# Altium schematic sheet 手环.SchDoc
size E
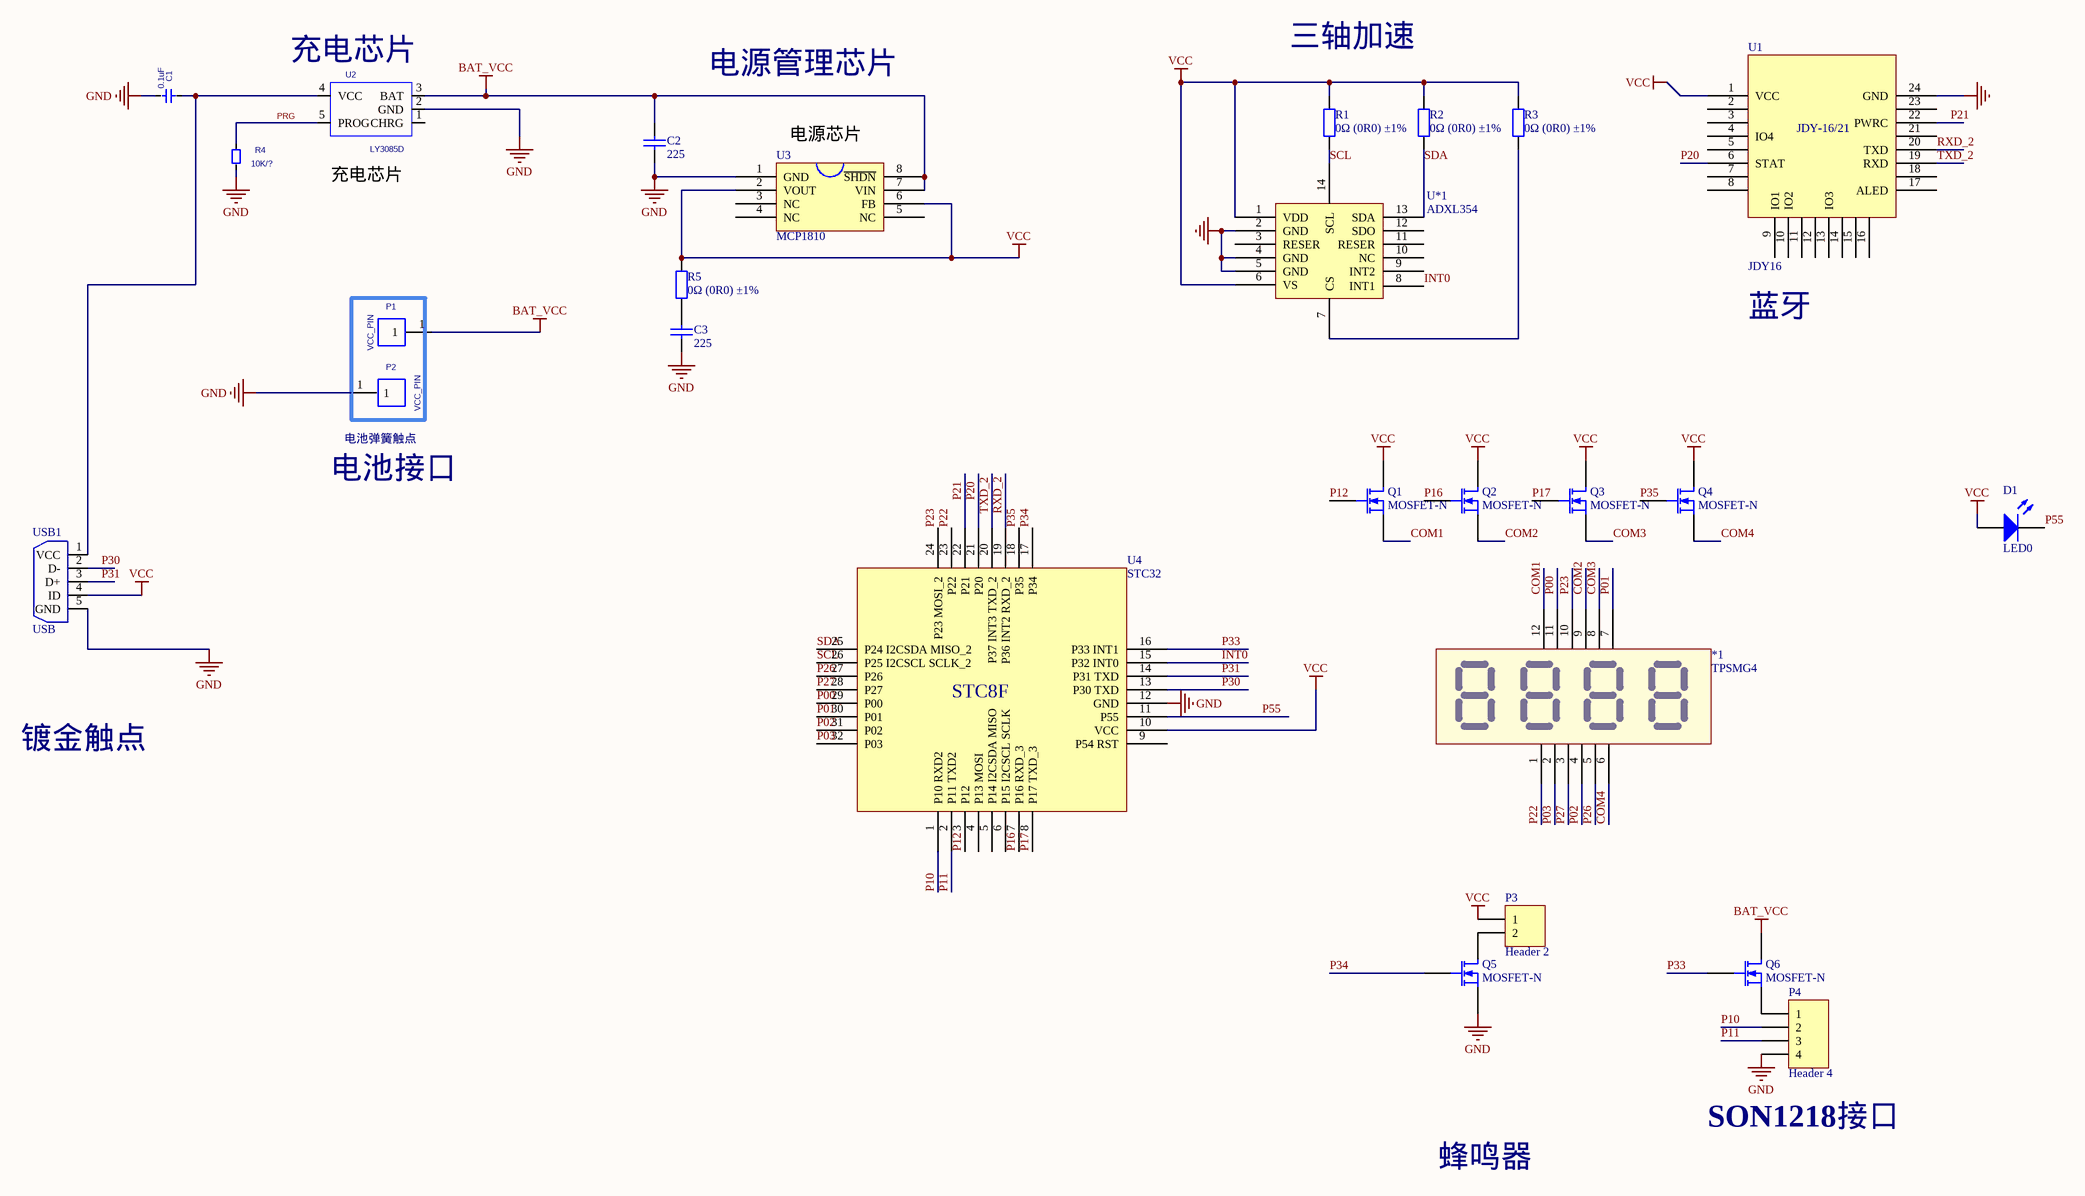
[diagram p0: 手环.SchDoc]

## Parts
*1  TPSMG4  [TPSMG4]
C1  0.1uF  [0603LED1]
C2  225  [0603LED1]
C3  225  [0603LED1]
D1  LED0  [0603LED1]
P1  VCC_PIN  [SMDCD]
P2  VCC_PIN  [SMDCD]
P3  Header 2  [DET402]
P4  Header 4  [FPC4]
Q1  MOSFET-N  [TPMOS]
Q2  MOSFET-N  [TPMOS]
Q3  MOSFET-N  [TPMOS]
Q4  MOSFET-N  [TPMOS]
Q5  MOSFET-N  [TPMOS]
Q6  MOSFET-N  [TPMOS]
R1  0Ω (0R0) ±1%  [0603LED1]
R2  0Ω (0R0) ±1%  [0603LED1]
R3  0Ω (0R0) ±1%  [0603LED1]
R4  value 10K/?  [0603LED1]  (hidden comment: 10K-0402 1%)
R5  0Ω (0R0) ±1%  [0603LED1]
U1  JDY16  [JDY16]
U2  LY3085D  [SOT-23-5]
U3  MCP1810  [J8A]
U4  STC32  [QFN32]
U*1  ADXL354  [ADXL345]
USB1  USB  [MICRO-USB-插脚-卷边]

## Nets
BAT_VCC: C2.1 P1.1 Q6.1(D) U2.3(BAT) U3.7(VIN) U3.8(~{SHDN})
GND: C1.2 C2.2 C3.2 P2.1 P4.4 Q5.3(S) R4.1 U1.24(GND) U2.2(GND) U3.1(GND) U4.12(GND) U*1.2(GND) U*1.4(GND) U*1.5(GND) USB1.5(GND)
VCC: D1.1(A) P3.1 Q1.1(D) Q2.1(D) Q3.1(D) Q4.1(D) R1.1 R2.1 R3.1 R5.2 U1.1(VCC) U3.2(VOUT) U3.6(FB) U4.10(VCC) U*1.1(VDD) U*1.6(VS) USB1.4(ID)
COM1: *1.12 Q1.3(S)
COM2: *1.9 Q2.3(S)
COM3: *1.8 Q3.3(S)
COM4: *1.6 Q4.3(S)
INT0: U4.15(P32_INT0) U*1.8(INT1)
P00: *1.11 U4.29(P00)
P01: *1.7 U4.30(P01)
P02: *1.4 U4.31(P02)
P03: *1.2 U4.32(P03)
P10: P4.2 U4.1(P10_RXD2)
P11: P4.3 U4.2(P11_TXD2)
P12: Q1.2(G) U4.3(P12)
P16: Q2.2(G) U4.7(P16_RXD_3)
P17: Q3.2(G) U4.8(P17_TXD_3)
P20: U1.6(STAT) U4.21(P20)
P21: U1.22(PWRC) U4.22(P21)
P22: *1.1 U4.23(P22)
P23: *1.10 U4.24(P23_MOSI_2)
P26: *1.5 U4.27(P26)
P27: *1.3 U4.28(P27)
P30: U4.13(P30_TXD) USB1.2(D-)
P31: U4.14(P31_TXD) USB1.3(D+)
P33: Q6.2(G) U4.16(P33_INT1)
P34: Q5.2(G) U4.17(P34)
P35: Q4.2(G) U4.18(P35)
P55: D1.2(K) U4.11(P55)
PRG: R4.2 U2.5(PROG)
RXD_2: U1.20(TXD) U4.19(P36_INT2_RXD_2)
SCL: R1.2 U4.26(P25_I2CSCL_SCLK_2) U*1.14(SCL)
SDA: R2.2 U4.25(P24_I2CSDA_MISO_2) U*1.13(SDA)
TXD_2: U1.19(RXD) U4.20(P37_INT3_TXD_2)
NetC1_1: C1.1 U2.4(VCC) USB1.1(VCC)
NetC3_1: C3.1 R5.1
NetP3_2: P3.2 Q5.1(D)
NetP4_1: P4.1 Q6.3(S)
NetR3_2: R3.2 U*1.7(CS)

Not connected (* = marked no-connect by the designer): U1 2 3 4(IO4) 5 7 8 9(IO1) 10(IO2) 11 12 13(IO3) 14 15 16 17(ALED) 18 21 23; U2 1(CHRG); U3 3(NC) 4(NC) 5(NC); U4 4(P13_MOSI) 5(P14_I2CSDA_MISO) 6(P15_I2CSCL_SCLK) 9(P54_RST); U*1 3(RESER) 9(INT2) 10(NC) 11(RESER) 12(SDO)

## Notes on the sheet
- (near U2) 充电芯片
- 电源管理芯片
- 三轴加速
- (near U3) 电源芯片
- 蓝牙
- 电池接口
- (near P2) 电池弹簧触点
- 镀金触点
- 蜂鸣器
- (near P4) SON1218接口
- (in symbol JDY21) JDY-16/21
- (in symbol STC32) STC8F

## Library data of the parts
C1 = C: 0.1uF-0402; PCB DECAL: 0805; VALUE: 0.1uF
C2 C3 = Cap_1206: 1206贴片电容; Package: 1206; 常见贴片电容尺寸图: https://wenku.baidu.com/view/21d5206100f69e3143323968011ca300a6c3f6b2.html; Value: 225
D1 = LED0: Typical INFRARED GaAs LED; Published: 8-Jun-2000; LatestRevisionDate: 08-Jul-2005; LatestRevisionNote: Mech Layer 1 removed.; PackageReference: LED-0; Publisher: Altium Limited; PackageDescription: LED; 2 Leads
P1 P2 = VCC_PIN: PCB DECAL: PWR_USB
P3 = Header 2: Header, 2-Pin; LatestRevisionDate: 17-Jul-2002; LatestRevisionNote: Re-released for DXP Platform.; Publisher: Altium Limited
P4 = Header 4: Header, 4-Pin; LatestRevisionDate: 17-Jul-2002; LatestRevisionNote: Re-released for DXP Platform.; Publisher: Altium Limited
Q1-Q6 = MOSFET-N: N-Channel MOSFET; Published: 8-Jun-2000; LatestRevisionDate: 17-Jul-2002; LatestRevisionNote: Re-released for DXP Platform.; PackageVersion: 1995/1996; PackageReference: E3; Publisher: Altium Limited; PackageDescription: TO, Flat Index; 3 In-Line, Axial Leads; Body Dia. 4.6mm; Lead Dia. 0.5 mm (max)
R1-R3 R5 = Res_0603: 贴片电阻; ComponentLink1Description: 供应商链接; ComponentLink1URL: http://www.szlcsc.com/product/details_21903.html; Package: 0603; Supplier: LC; SuppliersPartNumber: C21189
R4 = RSET: PCB DECAL: 0402
U1 = JDY21
U2 = TP4055-42-SOT25-R: VALUE: LY3085D; PCB DECAL: SOT-23-5
U3 = MCP1810: 2.7-V TO 5.5-V LOW-POWER DUAL 12-BIT DIGITAL-TO-ANALOG CONVERTER WITH  INTERNAL REFERENCE AND POWER DOWN; 按下F1: 选中器件，按下F1即可查看器件datasheet; HelpURL: http://pdf1.alldatasheetcn.com/datasheet-pdf/view/844425/TI1/TLV5638M.html
USB1 = USB5